# EAGLE design ui (EAGLE 9.2.2)
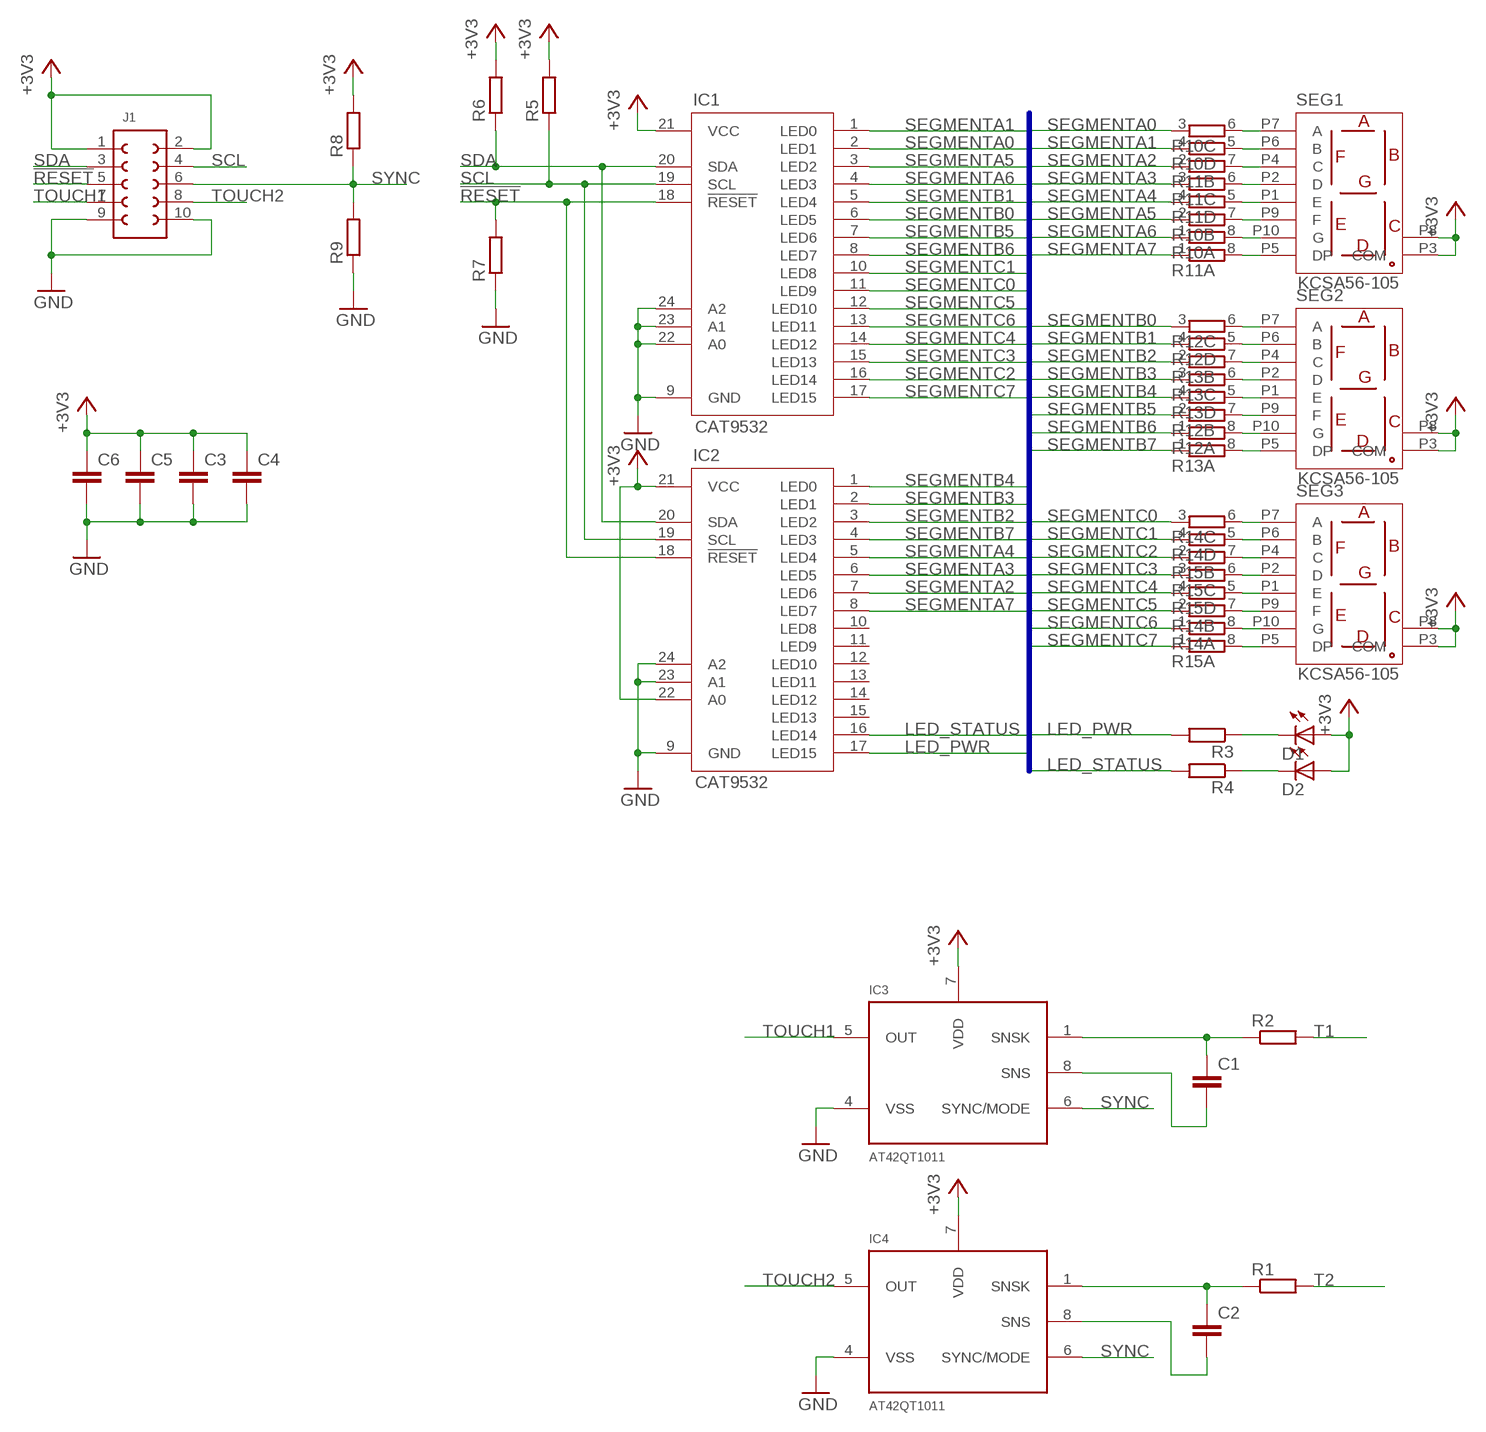
[diagram p0: schematic, sheet 1]

## Parts
C1  C-EUC0603  [C0603]
C2  C-EUC0603  [C0603]
C3  C-EUC0603  [C0603]
C4  C-EUC0603  [C0603]
C5  C-EUC0603  [C0603]
C6  C-EUC0603  [C0603]
D1  KPTL-3216  [LED-REV]
D2  KPTL-3216  [LED-REV]
IC1  CAT9532  [TQFN24-EP]
IC2  CAT9532  [TQFN24-EP]
IC3  AT42QT1011  [UDFN/USON_8_PAD]
IC4  AT42QT1011  [UDFN/USON_8_PAD]
J1  610X1021121  [610X1021121]
R1  R-EU_R0603  [R0603]
R2  R-EU_R0603  [R0603]
R3  R-EU_R0603  [R0603]
R4  R-EU_R0603  [R0603]
R5  R-EU_R0603  [R0603]
R6  R-EU_R0603  [R0603]
R7  R-EU_R0603  [R0603]
R8  R-EU_R0603  [R0603]
R9  R-EU_R0603  [R0603]
R10  4R-NCAT16  [CAT16]
R11  4R-NCAT16  [CAT16]
R12  4R-NCAT16  [CAT16]
R13  4R-NCAT16  [CAT16]
R14  4R-NCAT16  [CAT16]
R15  4R-NCAT16  [CAT16]
SEG1  KCSA56-105  [KCSA56-REV]
SEG2  KCSA56-105  [KCSA56-REV]
SEG3  KCSA56-105  [KCSA56-REV]

## Nets
!RESET: IC1.18(!RESET) IC2.18(!RESET) J1.5 R7.2
+3V3: C3.1 C4.1 C5.1 C6.1 D1.P$1(A) D2.P$1(A) IC1.21(VCC) IC2.21(VCC) IC2.22(A0) IC3.7(VDD) IC4.7(VDD) J1.1 J1.2 R5.2 R6.2 R8.2 SEG1.P3(COM) SEG1.P8 SEG2.P3(COM) SEG2.P8 SEG3.P3(COM) SEG3.P8
GND: C3.2 C4.2 C5.2 C6.2 IC1.9(GND) IC1.22(A0) IC1.23(A1) IC1.24(A2) IC2.9(GND) IC2.23(A1) IC2.24(A2) IC3.4(VSS) IC4.4(VSS) J1.9 J1.10 R7.1 R9.1
LED_PWR: IC2.17(LED15) R3.2
LED_STATUS: IC2.16(LED14) R4.2
N$1: R10.8 SEG1.P10(G)
N$2: R10.7 SEG1.P9(F)
N$3: R10.6 SEG1.P7(A)
N$4: R10.5 SEG1.P6(B)
N$5: R12.8 SEG2.P10(G)
N$6: R12.7 SEG2.P9(F)
N$7: R12.6 SEG2.P7(A)
N$8: R12.5 SEG2.P6(B)
N$9: R14.8 SEG3.P10(G)
N$10: R14.7 SEG3.P9(F)
N$11: R14.6 SEG3.P7(A)
N$12: R14.5 SEG3.P6(B)
N$13: R11.8 SEG1.P5(DP)
N$14: R11.7 SEG1.P4(C)
N$15: R11.6 SEG1.P2(D)
N$16: R11.5 SEG1.P1(E)
N$17: R13.8 SEG2.P5(DP)
N$18: R13.7 SEG2.P4(C)
N$19: R13.6 SEG2.P2(D)
N$20: R13.5 SEG2.P1(E)
N$21: R15.8 SEG3.P5(DP)
N$22: R15.7 SEG3.P4(C)
N$23: R15.6 SEG3.P2(D)
N$24: R15.5 SEG3.P1(E)
N$25: C1.1 IC3.1(SNSK) R2.1
N$26: C1.2 IC3.8(SNS)
N$27: D1.P$2(C) R3.1
N$28: C2.1 IC4.1(SNSK) R1.1
N$29: C2.2 IC4.8(SNS)
N$30: D2.P$2(C) R4.1
SCL: IC1.19(SCL) IC2.19(SCL) J1.4 R5.1
SDA: IC1.20(SDA) IC2.20(SDA) J1.3 R6.1
SEGMENTA0: IC1.2(LED1) R10.3
SEGMENTA1: IC1.1(LED0) R10.4
SEGMENTA2: IC2.7(LED6) R11.2
SEGMENTA3: IC2.6(LED5) R11.3
SEGMENTA4: IC2.5(LED4) R11.4
SEGMENTA5: IC1.3(LED2) R10.2
SEGMENTA6: IC1.4(LED3) R10.1
SEGMENTA7: IC2.8(LED7) R11.1
SEGMENTB0: IC1.6(LED5) R12.3
SEGMENTB1: IC1.5(LED4) R12.4
SEGMENTB2: IC2.3(LED2) R13.2
SEGMENTB3: IC2.2(LED1) R13.3
SEGMENTB4: IC2.1(LED0) R13.4
SEGMENTB5: IC1.7(LED6) R12.2
SEGMENTB6: IC1.8(LED7) R12.1
SEGMENTB7: IC2.4(LED3) R13.1
SEGMENTC0: IC1.11(LED9) R14.3
SEGMENTC1: IC1.10(LED8) R14.4
SEGMENTC2: IC1.16(LED14) R15.2
SEGMENTC3: IC1.15(LED13) R15.3
SEGMENTC4: IC1.14(LED12) R15.4
SEGMENTC5: IC1.12(LED10) R14.2
SEGMENTC6: IC1.13(LED11) R14.1
SEGMENTC7: IC1.17(LED15) R15.1
SYNC: IC3.6(SYNC/MODE) IC4.6(SYNC/MODE) J1.6 R8.1 R9.2
T1: R2.2
T2: R1.2
TOUCH1: IC3.5(OUT) J1.7
TOUCH2: IC4.5(OUT) J1.8
Unconnected: IC2.10(LED8) IC2.11(LED9) IC2.12(LED10) IC2.13(LED11) IC2.14(LED12) IC2.15(LED13)

## Buses
LED_PWR,LED_STATUS,SEGMENTA[0..7],SEGMENTB[0..7],SEGMENTC[0..7]

## Library data of the parts
C1-C6 = rcl:C-EU: CAPACITOR, European symbol; SPICEPREFIX: C
D1 D2 = comp:KPTL-3216
IC1 IC2 = comp:CAT9532
IC3 IC4 = local_parts:AT42QT1011: Atmel AT42QT1011 The AT42QT1011 (QT1011) is a digital burst mode charge-transfer (QT™) sensor that is capable of detecting nearproximity or touch, making it ideal for implementing touch controls. The QT1011 is designed specifically for human interfaces, like control panels, appliances, toys, lighting controls, or anywhere a mechanical switch or button may be found. It includes all hardware and signal processing functions necessary to provide stable sensing under a wide variety of changing conditions. Only a single low-cost capacitor is required for operation. This chip is identical to the AT42QT1010, however the capsense never times out. Reciprocally, the capsense on the 1010 times out after 60 seconds. Reference "Signal Processing" in the datasheet. Datasheet <http://www.atmel.com/images/Atmel-9542-AT42-QTouch-BSW-AT42QT1011_Datasheet.pdf> Sparkfun Products Sparkfun Capacitive Touch Breakout <https://www.sparkfun.com/products/12041> (SEN-12041)
J1 = Eagle_BOARD-TO-BOARD_CONNECTORS (rev18b):610X1021121: WR-PHD 2.54mm Dual SMT Pin Header, 10 Pins =>Code : Con_BTB_PHD_2.54_2_610x1021121(packageing:x = 0: Tube x = 3: Tape & Reel with Cap; 300 pcs/Reel) <http://katalog.we-online.de/media/images/eican/Con_BTB_PHD_2.54_2_6100xx21121_pf2.jpg> 6100xx21121 Details see: http://katalog.we-online.de/en/em/610_0xx_211_21 6103xx21121 Details see: http://katalog.we-online.de/en/em/PHD_2_54_SMT_DUAL_PIN_HEADER_REEL_6103XX21121 2014 (C) Würth Elektronik
R1-R9 = rcl:R-EU_: RESISTOR, European symbol; SPICEPREFIX: R
R10-R15 = resistor-dil:4R-N: Array Chip Resistor Source: RS Component / Phycomp; OC_FARNELL: unknown; OC_NEWARK: unknown
SEG1-SEG3 = comp:KCSA56-105

## Board
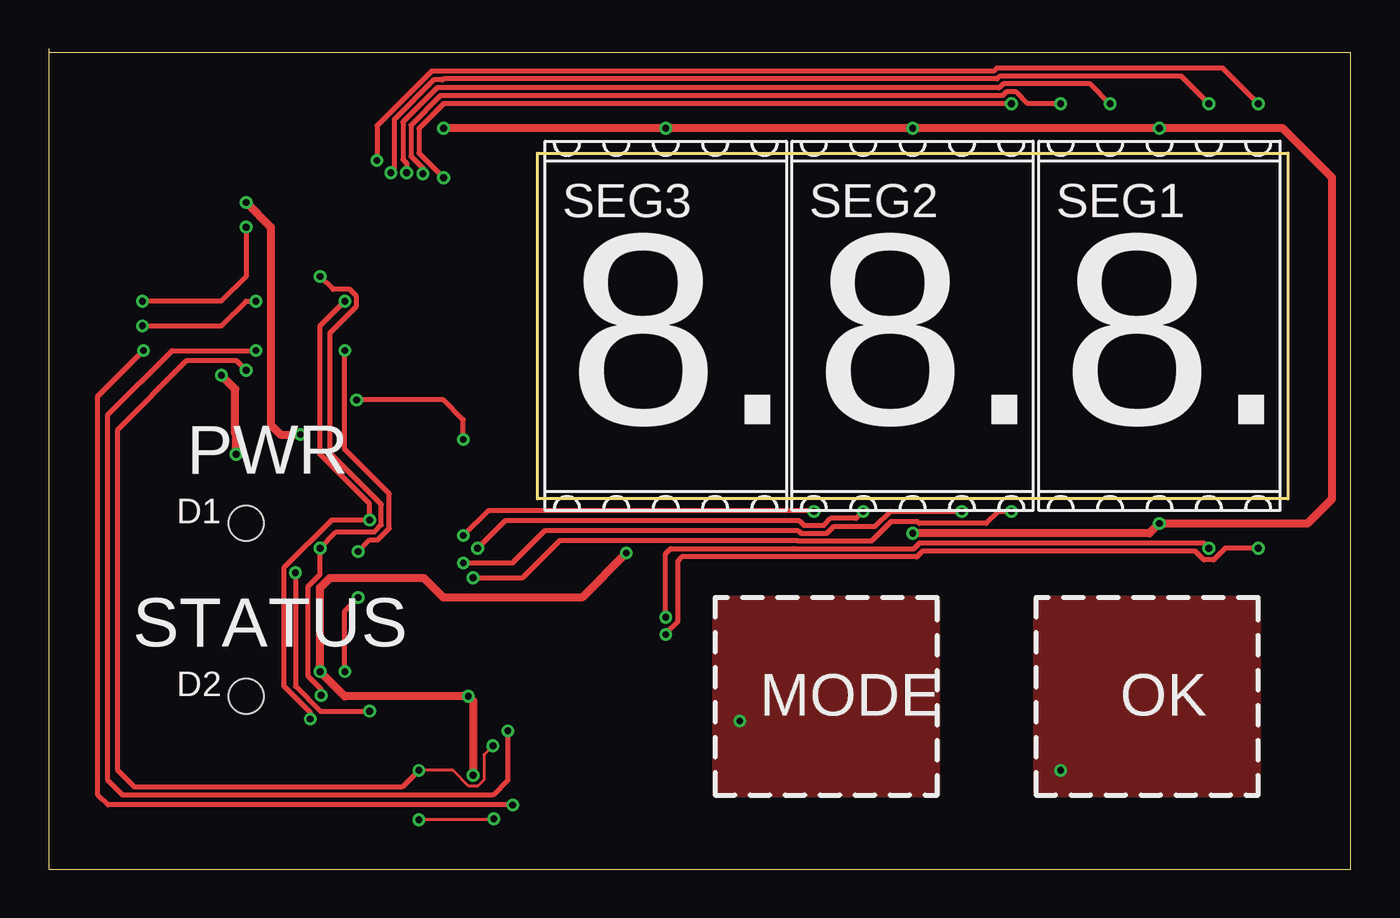
[diagram p1: board, top side]
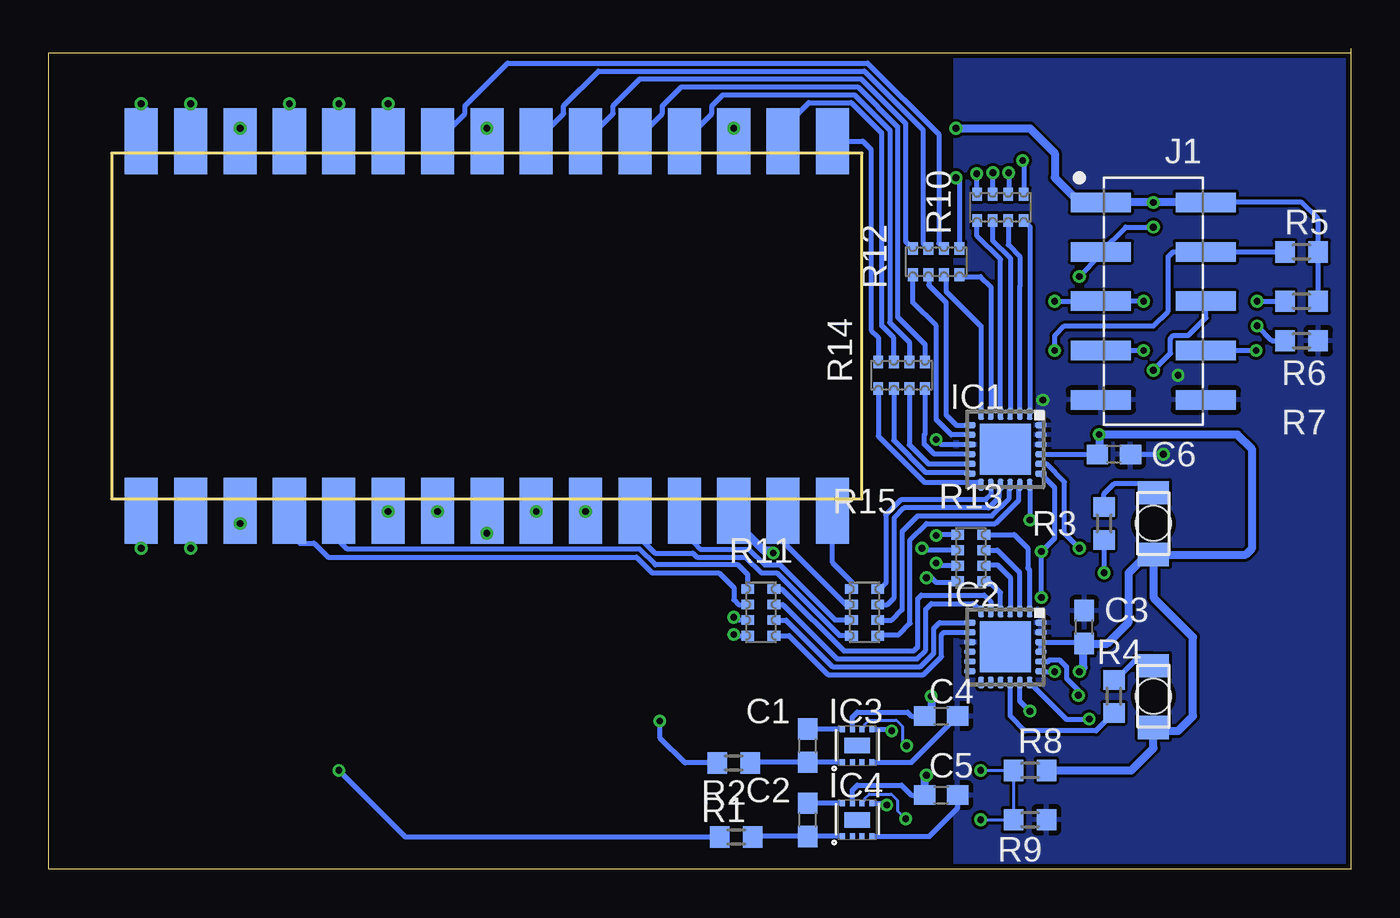
[diagram p2: board, bottom side, seen from below]

Size 67 x 42.2 mm. Coordinates in mm from the lower left corner, seen from the top.
Outline: 0,42 67,42 67,0 0,0 0,42
Outline: 0,42.2 0,42
Outline: 25.15,36.83 63.75,36.83 63.75,19.05 25.15,19.05 25.15,36.83
Copper layers (1*16): Top 0.035mm / dielectric 1.5mm / Bottom 0.035mm
Design rules "SeeedStudio_2layer_DRU_no_angle_20140221": minimum track width 6mil, minimum drill 12mil, track to track 6mil, track to pad 6mil, pad to pad 6mil, via to via 6mil, smd to smd 0mil, copper to edge 10mil, drill to drill 10mil, minimum pad ring 10mil, minimum via ring 6mil, stop-mask expansion 2mil, vias tented up to drill 100mil, thermal gap 10mil

### Footprints (pad centres in the part's own frame; a part is rotated, then mirrored left to right if it is on the bottom)
C0603 = smd 1.1 x 1: 1 -0.85,0; 2 0.85,0
LED-REV = smd 1.6 x 1.2 bottom: P$1 0,-1.6; P$2 0,1.575 | hole 1.8: 0,0
TQFN24-EP = smd 0.6 x 0.3: 1 -1.825,1.25; 2 -1.825,0.75; 3 -1.825,0.25; 4 -1.825,-0.25; 5 -1.825,-0.75; 6 -1.825,-1.25; 13 1.825,-1.25; 14 1.825,-0.75; 15 1.825,-0.25; 16 1.825,0.25; 17 1.825,0.75; 18 1.825,1.25 | smd 0.3 x 0.6: 7 -1.25,-1.825; 8 -0.75,-1.825; 9 -0.25,-1.825; 10 0.25,-1.825; 11 0.75,-1.825; 12 1.25,-1.825; 19 1.25,1.825; 20 0.75,1.825; 21 0.25,1.825; 22 -0.25,1.825; 23 -0.75,1.825; 24 -1.25,1.825 | smd 2.63 x 2.63: EXP 0,0
UDFN/USON_8_PAD = smd 0.25 x 0.3: 1 -0.75,-0.852; 2 -0.25,-0.852; 3 0.25,-0.852; 4 0.75,-0.852; 5 0.75,0.852; 6 0.25,0.852; 7 -0.25,0.852; 8 -0.75,0.852 | smd 1.3 x 0.8: P$1 0,0
610X1021121 = smd 1 x 3.1: 1 -5.08,-2.7; 2 -5.08,2.7; 3 -2.54,-2.7; 4 -2.54,2.7; 5 0,-2.7; 6 0,2.7; 7 2.54,-2.7; 8 2.54,2.7; 9 5.08,-2.7; 10 5.08,2.7
R0603 = smd 1 x 1.1: 1 -0.85,0; 2 0.85,0
CAT16 = smd 0.5 x 0.65: 1 -1.2,-0.675; 2 -0.4,-0.675; 3 0.4,-0.675; 4 1.2,-0.675; 5 1.2,0.675; 6 0.4,0.675; 7 -0.4,0.675; 8 -1.2,0.675
KCSA56-REV = smd 1.7 x 3.4 bottom: P1 -5.08,-9.5; P2 -2.54,-9.5; P3 0,-9.5; P4 2.54,-9.5; P5 5.08,-9.5; P6 5.08,9.5; P7 2.54,9.5; P8 0,9.5; P9 -2.54,9.5; P10 -5.08,9.5

### Placement (x,y rotation side)
C1  27.94,6.35 90 bottom
C2  27.94,2.54 90 bottom
C3  13.72,12.45 90 bottom
C4  21.08,7.87 0 bottom
C5  21.08,3.81 0 bottom
C6  12.19,21.34 0 bottom
D1  10.16,17.78 0 top
D2  10.16,8.89 0 top
IC1  17.78,21.59 270 bottom
IC2  17.78,11.43 270 bottom
IC3  25.4,6.35 0 bottom
IC4  25.4,2.54 0 bottom
J1  10.16,29.21 270 bottom
R1  31.62,1.65 180 bottom
R2  31.75,5.46 180 bottom
R3  12.7,17.78 270 bottom
R4  12.19,8.89 270 bottom
R5  2.54,31.75 0 bottom
R6  2.54,29.21 0 bottom
R7  2.54,27.18 180 bottom
R8  16.51,5.08 0 bottom
R9  16.51,2.54 180 bottom
R10  18.03,34.04 0 bottom
R11  30.35,13.21 90 bottom
R12  21.34,31.24 0 bottom
R13  19.56,16 90 bottom
R14  23.11,25.4 0 bottom
R15  25.02,13.21 90 bottom
SEG1  57.15,27.94 0 top
SEG2  44.45,27.94 0 top
SEG3  31.75,27.94 0 top

### Tracks (layer width: path | path; a pad name or v marks a point on that pad's centre or on a via)
!RESET  (via drill 0.35)
  Top 0.254: v13.46,7.72 13.46,8.06 12.09,9.43 12.09,15.49 14.55,17.95 v16.51,17.95 16.51,18.8 13.97,21.34 13.97,27.94 v15.24,29.21 | v4.83,27.94 8.89,27.94 10.16,29.21 v10.67,29.21
  Bottom 0.254: IC2.18 14.64,7.72 v13.46,7.72 | IC1.18 16.51,19.75 v16.51,17.95 | v15.24,29.21 J1.5 v10.67,29.21 | v4.83,27.94 4.06,27.18 R7.2
+3V3  (via drill 0.35)
  Top 0.406: v21.84,4.83 21.84,8.64 v21.59,8.89 15.24,8.89 v13.97,10.16 13.97,14.48 14.48,14.99 19.3,14.99 20.32,13.97 27.43,13.97 v29.72,16.26 | v44.45,17.27 56.64,17.27 v57.15,17.78 64.77,17.78 66.04,19.05 66.04,35.56 63.5,38.1 v57.15,38.1 v44.45,38.1 v31.75,38.1 v20.32,38.1 | v12.95,22.35 11.94,22.35 11.43,22.86 11.43,33.02 v10.16,34.29
  Bottom 0.254: IC1.21 C6.1 | C3.1 13.76,11.64 13.8,11.68 IC2.22 IC2.21 | IC3.7 25.65,7.83 25.4,8.07 22.81,8.07 22.61,7.87 C4.1 | IC4.7 25.65,4.06 25.4,4.32 23.11,4.32 22.61,3.81 C5.1 | R6.2 R5.2 1.69,33.44 2.54,34.29 J1.2 | D2.P$1 10.16,7.11 | SEG1.P3 57.15,18.52 | SEG1.P8 v57.15,38.1 | SEG2.P8 v44.45,38.1 | SEG3.P8 v31.75,38.1
  Bottom 0.406: v21.84,4.83 21.93,4.74 C5.1 | v21.59,8.89 21.59,8.22 C4.1 | v13.97,10.16 13.76,10.37 13.76,11.64 | 57.15,18.52 v57.15,17.78 | J1.2 v10.16,34.29 J1.1 13.97,34.29 15.24,35.56 15.24,36.83 16.51,38.1 v20.32,38.1 | C6.1 12.95,21.43 v12.95,22.35 5.84,22.35 5.08,21.59 5.08,16.51 5.41,16.18 D1.P$1 | D1.P$1 10.16,13.97 8.13,11.94 8.13,7.87 8.89,7.11 10.16,7.11 10.16,6.22 11.3,5.08 R8.2 | D1.P$1 10.16,16.51 11.43,15.24 11.43,12.7 12.53,11.6 C3.1 | SEG2.P3 v44.45,17.27 | v29.72,16.26 29.85,16.38 30.21,16.38 31.75,17.93 SEG3.P3
GND  (via drill 0.35)
  Top 0.254: v21.34,22.1 21.34,23.11 20.32,24.13 v15.85,24.13
  Top 0.406: v9.65,21.34 9.65,22.32 9.6,22.38 9.6,24.69 v8.89,25.4
  Bottom 0.254: IC3.4 22.61,5.5 C4.2 | IC4.4 21.68,1.69 20.23,3.14 C5.2 | IC1.9 21.08,21.84 v21.34,22.1 | C6.2 v9.65,21.34
  pour Bottom: 0,41.91 0,0 20.32,0 20.32,41.91 20.32,43.18 0,43.18
LED_PWR  (via drill 0.35)
  Top 0.254: v16.51,8.13 13.97,8.13 12.7,9.4 v12.7,15.24
  Bottom 0.254: v16.51,8.13 17.03,8.65 IC2.17 | R3.2 v12.7,15.24
LED_STATUS
  Bottom 0.254: R4.2 13.12,7.11 16.76,7.11 17.53,7.88 IC2.16
N$1  (via drill 0.35)
  Top 0.254: v52.07,39.37 50.39,39.37 49.78,39.98 49.28,39.98 49.08,39.78 20.15,39.78 18.64,38.27 18.64,36.66 19.26,36.05 v19.26,35.77
  Bottom 0.254: SEG1.P10 v52.07,39.37 | v19.26,35.77 19.26,34.73 R10.8
N$2  (via drill 0.35)
  Top 0.254: v54.61,39.37 53.6,40.38 49.11,40.38 48.91,40.18 19.98,40.18 18.24,38.44 18.24,36.49 18.41,36.32 v18.41,35.81
  Bottom 0.254: SEG1.P9 v54.61,39.37 | v18.41,35.81 18.43,35.8 R10.7
N$3  (via drill 0.35)
  Top 0.254: v59.69,39.37 58.27,40.79 48.94,40.79 48.79,40.64 20.32,40.64 20.27,40.59 19.82,40.59 17.78,38.55 17.78,35.99 v17.61,35.81
  Bottom 0.254: SEG1.P7 v59.69,39.37 | v17.61,35.81 17.61,34.74 R10.6
N$4  (via drill 0.35)
  Top 0.254: v62.23,39.37 60.4,41.2 48.77,41.2 48.62,41.05 19.7,41.05 16.89,38.24 v16.89,36.45
  Bottom 0.254: SEG1.P6 61.72,37.95 61.72,38.86 v62.23,39.37 | v16.89,36.45 16.83,36.39 R10.5
N$5
  Bottom 0.254: R12.8 22.91,32.29 22.91,38.35 25.2,40.64 36.58,40.64 37.96,39.26 37.96,38.85 SEG2.P10
N$6
  Bottom 0.254: R12.7 22.01,32.19 22.01,38.02 25.03,41.05 38.71,41.05 40.5,39.26 40.5,38.85 SEG2.P9
N$7
  Bottom 0.254: R12.6 21.21,32.19 21.21,37.8 24.86,41.45 43.38,41.45 45.58,39.26 45.58,38.85 SEG2.P7
N$8  (via drill 0.35)
  Top 0.254: v49.53,39.37 20.32,39.37 19.05,38.1 19.05,36.83 v20.32,35.56
  Bottom 0.254: SEG2.P6 v49.53,39.37 | v20.32,35.56 20.14,35.38 R12.5
N$9
  Bottom 0.254: SEG3.P10 25.11,37.44 24.69,37.02 24.69,27.72 24.31,27.34 R14.8
N$10
  Bottom 0.254: SEG3.P9 29.21,38.1 27.89,39.42 25.7,39.42 24.13,37.84 24.13,27.94 23.51,27.32 R14.7
N$11
  Bottom 0.254: SEG3.P7 32.88,38.85 32.88,39.26 32.31,39.83 25.54,39.83 23.72,38.01 23.72,28.11 22.71,27.1 R14.6
N$12
  Bottom 0.254: SEG3.P6 35.42,38.85 35.42,39.26 34.44,40.23 25.37,40.23 23.32,38.18 23.32,28.4 21.91,26.99 R14.5
N$13  (via drill 0.35)
  Top 0.254: v62.23,16.51 60.55,16.51 59.94,15.9 59.44,15.9 58.98,16.36 44.97,16.36 44.67,16.06 32.57,16.06 32.36,15.85 32.36,12.7 31.75,12.1 v31.75,12.06
  Bottom 0.254: SEG1.P5 v62.23,16.51 | v31.75,12.06 31.69,12.01 R11.8
N$14  (via drill 0.35)
  Top 0.254: v59.69,16.51 59.44,16.76 44.8,16.76 44.5,16.46 38.36,16.46 38.34,16.48 32,16.48 31.75,16.23 v31.75,12.95
  Bottom 0.254: SEG1.P4 v59.69,16.51 | R11.7 31.6,12.81 v31.75,12.95
N$15
  Bottom 0.254: SEG1.P2 54.1,17.93 54.1,16.76 53.34,16.76 52.63,16.05 36.76,16.05 35.95,15.24 32.51,15.24 31.75,14.48 31.75,13.84 31.52,13.61 R11.6
N$16
  Bottom 0.254: R11.5 31.03,15.15 31.52,15.65 35.78,15.65 36.59,16.46 51.64,16.46 52.07,16.89 SEG1.P1
N$17  (via drill 0.35)
  Top 0.254: v21.84,14.99 24.38,14.99 26.29,16.89 38.51,16.89 38.53,16.87 42.34,16.87 43.35,17.88 44.7,17.88 44.8,17.78 48.26,17.78 48.87,18.39 v49.53,18.39
  Bottom 0.254: R13.8 20.3,14.73 21.34,14.73 21.59,14.99 v21.84,14.99
  Bottom 0.406: SEG2.P5 v49.53,18.39
N$18  (via drill 0.35)
  Top 0.254: v21.34,15.75 23.88,15.75 25.53,17.4 38.58,17.4 38.7,17.28 40.05,17.28 40.41,17.63 42.52,17.63 43.31,18.41 46.97,18.41 v46.99,18.39
  Bottom 0.254: R13.7 21.19,15.6 v21.34,15.75 | SEG2.P4 v46.99,18.39
N$19  (via drill 0.35)
  Top 0.254: v22.07,16.51 23.47,17.91 38.64,17.91 38.87,17.68 39.88,17.68 40.24,18.04 41.55,18.04 v41.91,18.39
  Bottom 0.254: R13.6 21.97,16.4 v22.07,16.51 | v41.91,18.39 SEG2.P2
N$20  (via drill 0.35)
  Top 0.254: v39.37,18.39 SEG2.P1 22.61,18.43 v21.34,17.16
  Bottom 0.254: R13.5 21.29,17.2 v21.34,17.16
  Bottom 0.406: SEG2.P1 v39.37,18.39
N$21
  Bottom 0.254: R15.8 26.3,12.01 29.53,15.24 30.32,15.24 31.13,16.05 33.65,16.05 33.85,16.26 35.81,16.26 36.83,17.27 SEG3.P5
N$22
  Bottom 0.254: SEG3.P4 33.78,17.93 33.78,16.76 33.48,16.46 30.97,16.46 30.16,15.65 29.36,15.65 26.52,12.81 R15.7
N$23
  Bottom 0.254: R15.6 25.99,13.61 29.21,16.83 SEG3.P2
N$24
  Bottom 0.254: R15.5 25.69,14.79 26.67,15.77 SEG3.P1
N$25
  Bottom 0.254: IC3.1 C1.1 30.86,5.5 R2.1
N$26
  Bottom 0.254: IC3.8 C1.2
N$27
  Bottom 0.254: D1.P$2 10.62,19.81 12.19,19.81 12.7,19.3 R3.1
N$28
  Bottom 0.254: IC4.1 C2.1 30.73,1.69 R1.1
N$29
  Bottom 0.254: IC4.8 C2.2
N$30
  Bottom 0.254: D2.P$2 10.16,10.92 10.92,10.92 12.1,9.74 R4.1
SCL  (via drill 0.35)
  Top 0.254: v15.24,10.16 15.24,13.29 v15.92,13.97 | v15.92,16.34 16.53,16.94 16.93,16.94 17.52,17.53 17.52,19.31 15.24,21.59 v15.24,26.67
  Bottom 0.254: IC2.19 15.94,10.16 v15.24,10.16 | v15.92,13.97 v15.92,16.34 15.24,17.02 15.24,19.62 IC1.19 | v15.24,26.67 15.24,27.43 14.73,27.94 10.16,27.94 9.4,28.7 9.4,31.5 9.14,31.75 J1.4 R5.1
SDA  (via drill 0.35)
  Top 0.254: v14.02,8.94 14.02,9.25 13.36,9.91 13.36,14.55 13.97,15.16 v13.97,16.51 14.8,17.34 16.76,17.34 17.12,17.7 17.12,18.76 14.48,21.4 14.48,27.59 15.85,28.96 15.85,29.46 15.49,29.82 14.63,29.82 v13.97,30.48 | v10.16,33.02 10.16,30.48 8.89,29.21 v4.83,29.21
  Bottom 0.254: IC2.20 15.58,10.68 15.49,10.77 14.99,10.77 14.63,10.41 14.63,9.81 14.02,9.19 v14.02,8.94 | v13.97,16.51 14.73,17.27 14.73,19.92 15.65,20.84 IC1.20 | v13.97,30.48 12.86,31.59 J1.3 11.59,33.02 v10.16,33.02 | v4.83,29.21 R6.1
SEGMENTA0
  Bottom 0.254: IC1.2 17.03,29.21 17.03,29.96 17.03,31.51 17.63,32.11 R10.3
SEGMENTA1
  Bottom 0.254: IC1.1 16.51,23.43 16.51,33.04 R10.4
SEGMENTA2
  Bottom 0.254: IC2.7 21.17,12.68 21.46,12.38 21.46,11.1 22.15,10.41 26.67,10.41 29.06,12.81 R11.2
SEGMENTA3
  Bottom 0.254: IC2.6 19.43,13.65 21.59,13.65 21.87,13.37 21.87,11.27 22.32,10.82 26.44,10.82 29.23,13.61 R11.3
SEGMENTA4
  Bottom 0.254: IC2.5 18.53,13.77 18.86,14.1 22.1,14.1 22.28,13.92 22.28,11.44 22.49,11.22 26.09,11.22 29.27,14.41 R11.4
SEGMENTA5
  Bottom 0.254: R10.2 18.43,32.34 17.53,31.43 IC1.3
SEGMENTA6
  Bottom 0.254: IC1.4 18.03,31.36 19.23,32.56 R10.1
SEGMENTA7
  Bottom 0.254: IC2.8 20.94,12.18 21.06,12.06 21.06,10.93 21.99,10.01 26.9,10.01 28.9,12.01 R11.1
SEGMENTB0
  Bottom 0.254: IC1.6 19.03,27.94 19.05,27.94 20.83,29.72 20.83,30.46 R12.3
SEGMENTB1
  Bottom 0.254: R12.4 20.05,30.48 19.05,30.48 18.53,29.96 IC1.5
SEGMENTB2
  Bottom 0.254: IC2.3 17.53,14.99 18.19,15.65 18.88,15.65 R13.2
SEGMENTB3
  Bottom 0.254: IC2.2 17.03,15.24 18.19,16.4 R13.3
SEGMENTB4
  Bottom 0.254: IC2.1 16.53,15.39 16.62,15.48 16.62,16.51 17.32,17.2 R13.4
SEGMENTB5
  Bottom 0.254: IC1.7 20.3,22.84 20.83,23.37 20.83,29.14 21.72,30.04 21.72,30.55 R12.2
SEGMENTB6
  Bottom 0.254: IC1.8 20.56,22.34 21.34,23.11 21.34,27.94 22.54,29.14 R12.1
SEGMENTB7
  Bottom 0.254: IC2.4 18.03,14.22 18.61,14.8 R13.1
SEGMENTC0
  Bottom 0.254: IC1.11 21.73,20.84 22.71,21.82 R14.3
SEGMENTC1
  Bottom 0.254: R14.4 21.91,22.38 21.94,22.35 21.94,21.85 21.44,21.34 IC1.10
SEGMENTC2
  Bottom 0.254: IC1.16 17.6,19.69 17.6,19.03 18.46,18.17 22.28,18.17 23.09,17.36 23.09,13.34 23.62,12.81 R15.2
SEGMENTC3
  Bottom 0.254: IC1.15 18.1,19.69 18.1,19.11 18.63,18.58 22.99,18.58 23.5,18.07 23.5,13.97 23.86,13.61 R15.3
SEGMENTC4
  Bottom 0.254: IC1.14 18.53,19.25 18.8,18.99 23.16,18.99 23.93,18.21 23.93,14.7 24.22,14.41 R15.4
SEGMENTC5
  Bottom 0.254: IC1.12 19.68,20.41 21.88,20.41 23.51,22.05 R14.2
SEGMENTC6
  Bottom 0.254: IC1.13 19.18,19.91 21.95,19.91 24.31,22.27 R14.1
SEGMENTC7
  Bottom 0.254: IC1.17 17.1,19.69 17.1,18.96 18.29,17.77 21.84,17.77 22.68,16.93 22.68,12.64 23.26,12.06 24.29,12.06 R15.1
SYNC  (via drill 0.35)
  Top 0.152: v19.05,5.08 20.8,5.08 21.61,4.27 22.07,4.27 22.4,4.6 22.4,5.89 v22.86,6.35 | v22.91,2.59 22.86,2.54 v19.05,2.54
  Top 0.254: v19.05,5.08 18.19,4.22 4.42,4.22 3.56,5.08 3.56,22.61 7.11,26.16 9.65,26.16 v10.16,25.65
  Bottom 0.152: IC3.6 25.01,7.35 25.01,7.44 24.78,7.67 23.39,7.67 23.07,7.34 23.07,6.56 v22.86,6.35 | v19.05,5.08 R8.1 R9.2 v19.05,2.54 | IC4.6 25.01,3.54 25.01,3.63 24.78,3.86 23.65,3.86 23.32,3.53 23.32,3 v22.91,2.59
  Bottom 0.254: J1.6 7.46,28.35 8.37,27.45 9.13,27.45 9.29,27.29 9.29,26.52 v10.16,25.65
T1  (via drill 0.35)
  Bottom 0.254: R2.2 34.25,5.46 35.56,6.77 v35.56,7.62
  pour Top: 45.72,13.97 45.72,3.81 34.29,3.81 34.29,13.97
T2  (via drill 0.35)
  Bottom 0.254: v52.07,5.08 48.64,1.65 R1.2
  pour Top: 62.23,13.97 62.23,3.81 50.8,3.81 50.8,13.97
TOUCH1  (via drill 0.35)
  Top 0.254: v23.62,7.11 23.62,4.57 22.86,3.81 3.81,3.81 3.05,4.57 3.05,23.37 6.35,26.67 v10.67,26.67
  Bottom 0.254: IC3.5 23.71,7.2 v23.62,7.11 | v10.67,26.67 J1.7
TOUCH2  (via drill 0.35)
  Top 0.254: v23.88,3.3 3.05,3.3 2.54,3.81 2.54,24.33 v4.88,26.67
  Bottom 0.254: IC4.5 23.97,3.39 v23.88,3.3 | v4.88,26.67 J1.8

### Text on the board
tPlace: MODE | OK
tNames: PWR | STATUS